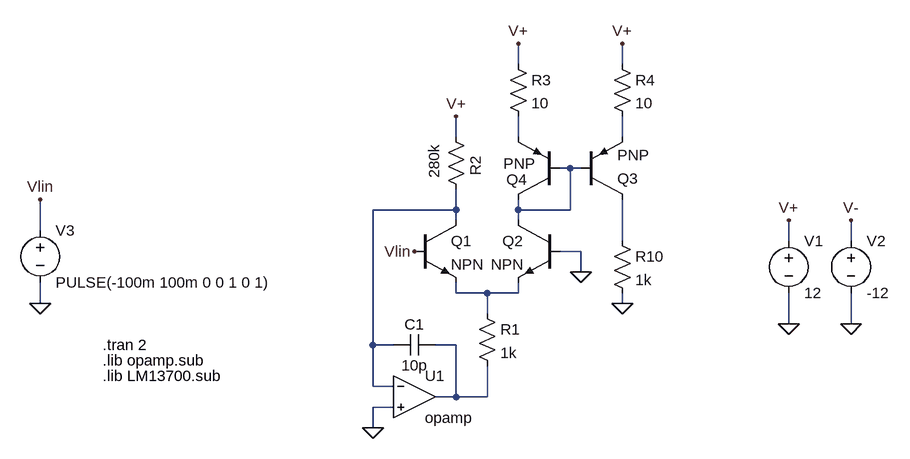
[diagram p0: schematic lin-to-exp.asc]
lin-to-exp.asc, the LTspice schematic file:
Version 4
SHEET 1 880 1348
WIRE 240 64 240 32
WIRE 400 64 400 32
WIRE 144 176 144 144
WIRE 240 176 240 144
WIRE 400 176 400 144
WIRE 320 224 304 224
WIRE 336 224 320 224
WIRE 144 288 144 256
WIRE 144 288 16 288
WIRE 240 288 240 272
WIRE 320 288 320 224
WIRE 320 288 240 288
WIRE 144 304 144 288
WIRE 240 304 240 288
WIRE -496 320 -496 272
WIRE 400 336 400 272
WIRE 656 336 656 304
WIRE 752 336 752 304
WIRE 336 352 304 352
WIRE 336 384 336 352
WIRE 144 416 144 400
WIRE 192 416 144 416
WIRE 240 416 240 400
WIRE 240 416 192 416
WIRE -496 432 -496 400
WIRE 400 432 400 416
WIRE 192 448 192 416
WIRE 656 464 656 416
WIRE 752 464 752 416
WIRE 16 496 16 288
WIRE 48 496 16 496
WIRE 144 496 112 496
WIRE 16 560 16 496
WIRE 48 560 16 560
WIRE 144 576 144 496
WIRE 144 576 112 576
WIRE 192 576 192 528
WIRE 192 576 144 576
WIRE 48 592 16 592
WIRE 16 624 16 592
FLAG 16 624 0
FLAG 656 464 0
FLAG 752 464 0
FLAG 656 304 V+
FLAG 752 304 V-
FLAG 144 144 V+
FLAG 336 384 0
FLAG 240 32 V+
FLAG 400 32 V+
FLAG -496 432 0
FLAG -496 272 Vlin
FLAG 80 352 Vlin
FLAG 400 432 0
SYMBOL Opamps\\opamp 80 512 R0
SYMATTR InstName U1
SYMBOL npn 80 304 R0
SYMATTR InstName Q1
SYMBOL npn 304 304 M0
SYMATTR InstName Q2
SYMBOL res 176 432 R0
SYMATTR InstName R1
SYMATTR Value 1k
SYMBOL cap 112 480 R90
WINDOW 0 0 32 VBottom 2
WINDOW 3 32 32 VTop 2
SYMATTR InstName C1
SYMATTR Value 10p
SYMBOL res 128 160 R0
WINDOW 0 46 45 VRight 2
WINDOW 3 -18 27 VRight 2
SYMATTR InstName R2
SYMATTR Value 280k
SYMBOL pnp 336 272 M180
SYMATTR InstName Q3
SYMBOL pnp 304 272 R180
WINDOW 0 50 31 Left 2
WINDOW 3 38 55 Left 2
SYMATTR InstName Q4
SYMBOL res 224 48 R0
SYMATTR InstName R3
SYMATTR Value 10
SYMBOL res 384 48 R0
SYMATTR InstName R4
SYMATTR Value 10
SYMBOL voltage 656 320 R0
WINDOW 123 0 0 Left 0
WINDOW 39 0 0 Left 0
SYMATTR InstName V1
SYMATTR Value 12
SYMBOL voltage 752 320 R0
WINDOW 123 0 0 Left 0
WINDOW 39 0 0 Left 0
SYMATTR InstName V2
SYMATTR Value -12
SYMBOL voltage -496 304 R0
WINDOW 123 0 0 Left 0
WINDOW 39 0 0 Left 0
SYMATTR InstName V3
SYMATTR Value PULSE(-100m 100m 0 0 1 0 1)
SYMBOL res 384 320 R0
SYMATTR InstName R10
SYMATTR Value 1k
TEXT -400 520 Left 2 !.lib opamp.sub
TEXT -400 496 Left 2 !.tran 2
TEXT -400 544 Left 2 !.lib LM13700.sub

The netlist it stands for:
* lin-to-exp.asc
XU1 N004 0 N007 opamp Aol=100K GBW=10Meg  ; pins invin noninvin out
Q1 N004 Vlin N006 0 NPN
Q2 N003 0 N006 0 NPN
R1 N006 N007 1k
C1 N007 N004 10p
R2 V+ N004 280k
Q3 N005 N003 N002 0 PNP
Q4 N003 N003 N001 0 PNP
R3 V+ N001 10
R4 V+ N002 10
V1 V+ 0 12
V2 V- 0 -12
V3 Vlin 0 PULSE(-100m 100m 0 0 1 0 1)
R10 N005 0 1k
.model NPN NPN
.model PNP PNP
.lib standard.bjt
.lib opamp.sub
.tran 2
.lib LM13700.sub
.backanno
.end